# EAGLE design LedSignalDispatcher (EAGLE 6.1)
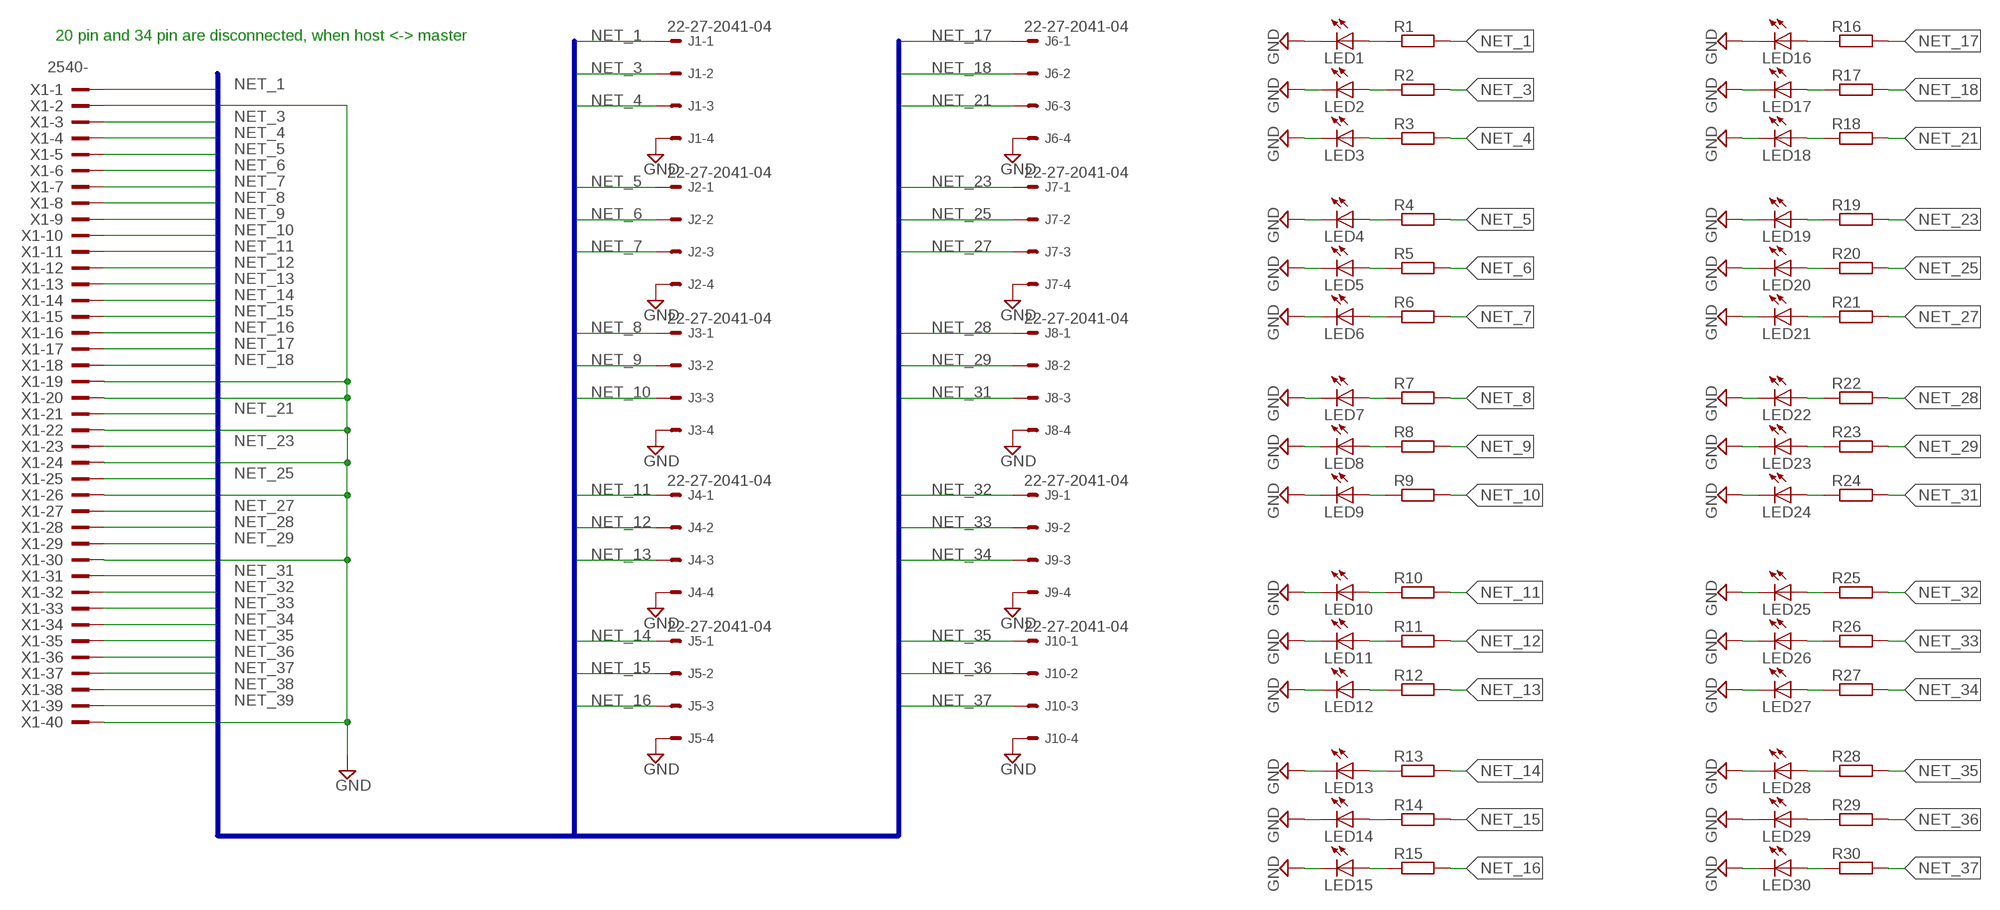
[diagram p0: schematic, sheet 1]

## Parts
J1  22-27-2041-04  [6410-04]
J2  22-27-2041-04  [6410-04]
J3  22-27-2041-04  [6410-04]
J4  22-27-2041-04  [6410-04]
J5  22-27-2041-04  [6410-04]
J6  22-27-2041-04  [6410-04]
J7  22-27-2041-04  [6410-04]
J8  22-27-2041-04  [6410-04]
J9  22-27-2041-04  [6410-04]
J10  22-27-2041-04  [6410-04]
LED1  LEDP-LCC-2  [P-LCC-2]
LED2  LEDP-LCC-2  [P-LCC-2]
LED3  LEDP-LCC-2  [P-LCC-2]
LED4  LEDP-LCC-2  [P-LCC-2]
LED5  LEDP-LCC-2  [P-LCC-2]
LED6  LEDP-LCC-2  [P-LCC-2]
LED7  LEDP-LCC-2  [P-LCC-2]
LED8  LEDP-LCC-2  [P-LCC-2]
LED9  LEDP-LCC-2  [P-LCC-2]
LED10  LEDP-LCC-2  [P-LCC-2]
LED11  LEDP-LCC-2  [P-LCC-2]
LED12  LEDP-LCC-2  [P-LCC-2]
LED13  LEDP-LCC-2  [P-LCC-2]
LED14  LEDP-LCC-2  [P-LCC-2]
LED15  LEDP-LCC-2  [P-LCC-2]
LED16  LEDP-LCC-2  [P-LCC-2]
LED17  LEDP-LCC-2  [P-LCC-2]
LED18  LEDP-LCC-2  [P-LCC-2]
LED19  LEDP-LCC-2  [P-LCC-2]
LED20  LEDP-LCC-2  [P-LCC-2]
LED21  LEDP-LCC-2  [P-LCC-2]
LED22  LEDP-LCC-2  [P-LCC-2]
LED23  LEDP-LCC-2  [P-LCC-2]
LED24  LEDP-LCC-2  [P-LCC-2]
LED25  LEDP-LCC-2  [P-LCC-2]
LED26  LEDP-LCC-2  [P-LCC-2]
LED27  LEDP-LCC-2  [P-LCC-2]
LED28  LEDP-LCC-2  [P-LCC-2]
LED29  LEDP-LCC-2  [P-LCC-2]
LED30  LEDP-LCC-2  [P-LCC-2]
R1  SMT-REF  [SMT-REF]
R2  SMT-REF  [SMT-REF]
R3  SMT-REF  [SMT-REF]
R4  SMT-REF  [SMT-REF]
R5  SMT-REF  [SMT-REF]
R6  SMT-REF  [SMT-REF]
R7  SMT-REF  [SMT-REF]
R8  SMT-REF  [SMT-REF]
R9  SMT-REF  [SMT-REF]
R10  SMT-REF  [SMT-REF]
R11  SMT-REF  [SMT-REF]
R12  SMT-REF  [SMT-REF]
R13  SMT-REF  [SMT-REF]
R14  SMT-REF  [SMT-REF]
R15  SMT-REF  [SMT-REF]
R16  SMT-REF  [SMT-REF]
R17  SMT-REF  [SMT-REF]
R18  SMT-REF  [SMT-REF]
R19  SMT-REF  [SMT-REF]
R20  SMT-REF  [SMT-REF]
R21  SMT-REF  [SMT-REF]
R22  SMT-REF  [SMT-REF]
R23  SMT-REF  [SMT-REF]
R24  SMT-REF  [SMT-REF]
R25  SMT-REF  [SMT-REF]
R26  SMT-REF  [SMT-REF]
R27  SMT-REF  [SMT-REF]
R28  SMT-REF  [SMT-REF]
R29  SMT-REF  [SMT-REF]
R30  SMT-REF  [SMT-REF]
X1  2540-  [PAK100/2500-40]

## Nets
GND: J1.4 J2.4 J3.4 J4.4 J5.4 J6.4 J7.4 J8.4 J9.4 J10.4 LED1.C LED2.C LED3.C LED4.C LED5.C LED6.C LED7.C LED8.C LED9.C LED10.C LED11.C LED12.C LED13.C LED14.C LED15.C LED16.C LED17.C LED18.C LED19.C LED20.C LED21.C LED22.C LED23.C LED24.C LED25.C LED26.C LED27.C LED28.C LED29.C LED30.C X1.2 X1.19 X1.20 X1.22 X1.24 X1.26 X1.30 X1.40
N$1: LED1.A R1.2
N$2: LED2.A R2.2
N$3: LED3.A R3.2
N$4: LED4.A R4.2
N$5: LED5.A R5.2
N$6: LED6.A R6.2
N$7: LED7.A R7.2
N$8: LED8.A R8.2
N$9: LED9.A R9.2
N$10: LED10.A R10.2
N$11: LED11.A R11.2
N$12: LED12.A R12.2
N$13: LED13.A R13.2
N$14: LED14.A R14.2
N$15: LED15.A R15.2
N$16: LED16.A R16.2
N$17: LED17.A R17.2
N$18: LED18.A R18.2
N$19: LED19.A R19.2
N$20: LED20.A R20.2
N$21: LED21.A R21.2
N$22: LED22.A R22.2
N$23: LED23.A R23.2
N$24: LED24.A R24.2
N$25: LED25.A R25.2
N$26: LED26.A R26.2
N$27: LED27.A R27.2
N$28: LED28.A R28.2
N$29: LED29.A R29.2
N$30: LED30.A R30.2
NET_1: J1.1 R1.1 X1.1
NET_3: J1.2 R2.1 X1.3
NET_4: J1.3 R3.1 X1.4
NET_5: J2.1 R4.1 X1.5
NET_6: J2.2 R5.1 X1.6
NET_7: J2.3 R6.1 X1.7
NET_8: J3.1 R7.1 X1.8
NET_9: J3.2 R8.1 X1.9
NET_10: J3.3 R9.1 X1.10
NET_11: J4.1 R10.1 X1.11
NET_12: J4.2 R11.1 X1.12
NET_13: J4.3 R12.1 X1.13
NET_14: J5.1 R13.1 X1.14
NET_15: J5.2 R14.1 X1.15
NET_16: J5.3 R15.1 X1.16
NET_17: J6.1 R16.1 X1.17
NET_18: J6.2 R17.1 X1.18
NET_21: J6.3 R18.1 X1.21
NET_23: J7.1 R19.1 X1.23
NET_25: J7.2 R20.1 X1.25
NET_27: J7.3 R21.1 X1.27
NET_28: J8.1 R22.1 X1.28
NET_29: J8.2 R23.1 X1.29
NET_31: J8.3 R24.1 X1.31
NET_32: J9.1 R25.1 X1.32
NET_33: J9.2 R26.1 X1.33
NET_34: J9.3 R27.1 X1.34
NET_35: J10.1 R28.1 X1.35
NET_36: J10.2 R29.1 X1.36
NET_37: J10.3 R30.1 X1.37
NET_38: X1.38
NET_39: X1.39

## Buses
NET_[1..40]

## Notes on the sheet
- 20 pin and 34 pin are disconnected, when host <-> master

## Library data of the parts
J1-J10 = con-molex:22-?-04: CONNECTOR wire to board 2.54 mm (.1 inch) pitch header; OC_FARNELL: unknown; OC_NEWARK: unknown
LED1-LED30 = led:LED: LED OSRAM: - CHIPLED LG R971, LG N971, LY N971, LG Q971, LY Q971, LO R971, LY R971 LH N974, LH R974 LS Q976, LO Q976, LY Q976 LO Q996 - Hyper CHIPLED LW Q18S LB Q993, LB Q99A, LB R99A - SideLED LS A670, LO A670, LY A670, LG A670, LP A670 LB A673, LV A673, LT A673, LW A673 LH A674 LY A675 LS A676, LA A676, LO A676, LY A676, LW A676 LS A679, LY A679, LG A679 - Hyper Micro SIDELED® LS Y876, LA Y876, LO Y876, LY Y876 LT Y87S - SmartLED LW L88C, LW L88S LB L89C, LB L89S, LG L890 LS L89K, LO L89K, LY L89K LS L896, LA L896, LO L896, LY L896 - TOPLED LS T670, LO T670, LY T670, LG T670, LP T670 LSG T670, LSP T670, LSY T670, LOP T670, LYG T670 LG T671, LOG T671, LSG T671 LB T673, LV T673, LT T673, LW T673 LH T674 LS T676, LA T676, LO T676, LY T676, LB T676, LH T676, LSB T676, LW T676 LB T67C, LV T67C, LT T67C, LS T67K, LO T67K, LY T67K, LW E67C LS E67B, LA E67B, LO E67B, LY E67B, LB E67C, LV E67C, LT E67C LW T67C LS T679, LY T679, LG T679 LS T770, LO T770, LY T770, LG T770, LP T770 LB T773, LV T773, LT T773, LW T773 LH T774 LS E675, LA E675, LY E675, LS T675 LS T776, LA T776, LO T776, LY T776, LB T776 LHGB T686 LT T68C, LB T68C - Hyper Mini TOPLED® LB M676 - Mini TOPLED Santana® LG M470 LS M47K, LO M47K, LY M47K Source: http://www.osram.convergy.de LUXEON: - LUMILED® LXK2-PW12-R00, LXK2-PW12-S00, LXK2-PW14-U00, LXK2-PW14-V00 LXK2-PM12-R00, LXK2-PM12-S00, LXK2-PM14-U00 LXK2-PE12-Q00, LXK2-PE12-R00, LXK2-PE12-S00, LXK2-PE14-T00, LXK2-PE14-U00 LXK2-PB12-K00, LXK2-PB12-L00, LXK2-PB12-M00, LXK2-PB14-N00, LXK2-PB14-P00, LXK2-PB14-Q00 LXK2-PR12-L00, LXK2-PR12-M00, LXK2-PR14-Q00, LXK2-PR14-R00 LXK2-PD12-Q00, LXK2-PD12-R00, LXK2-PD12-S00 LXK2-PH12-R00, LXK2-PH12-S00 LXK2-PL12-P00, LXK2-PL12-Q00, LXK2-PL12-R00 Source: www.luxeon.com KINGBRIGHT: KA-3528ASYC Source: www.kingbright.com
R1-R30 = resistor-shunt:SMT-REF: SMD SHUNT RESISTOR; OC_FARNELL: unknown; OC_NEWARK: unknown
X1 = con-3m:2540-: 3M (TM) Pak 100 4-Wall Header Source: 3M; OC_FARNELL: unknown; OC_NEWARK: unknown

## Net classes
0 default: width 0.203 mm

## Board
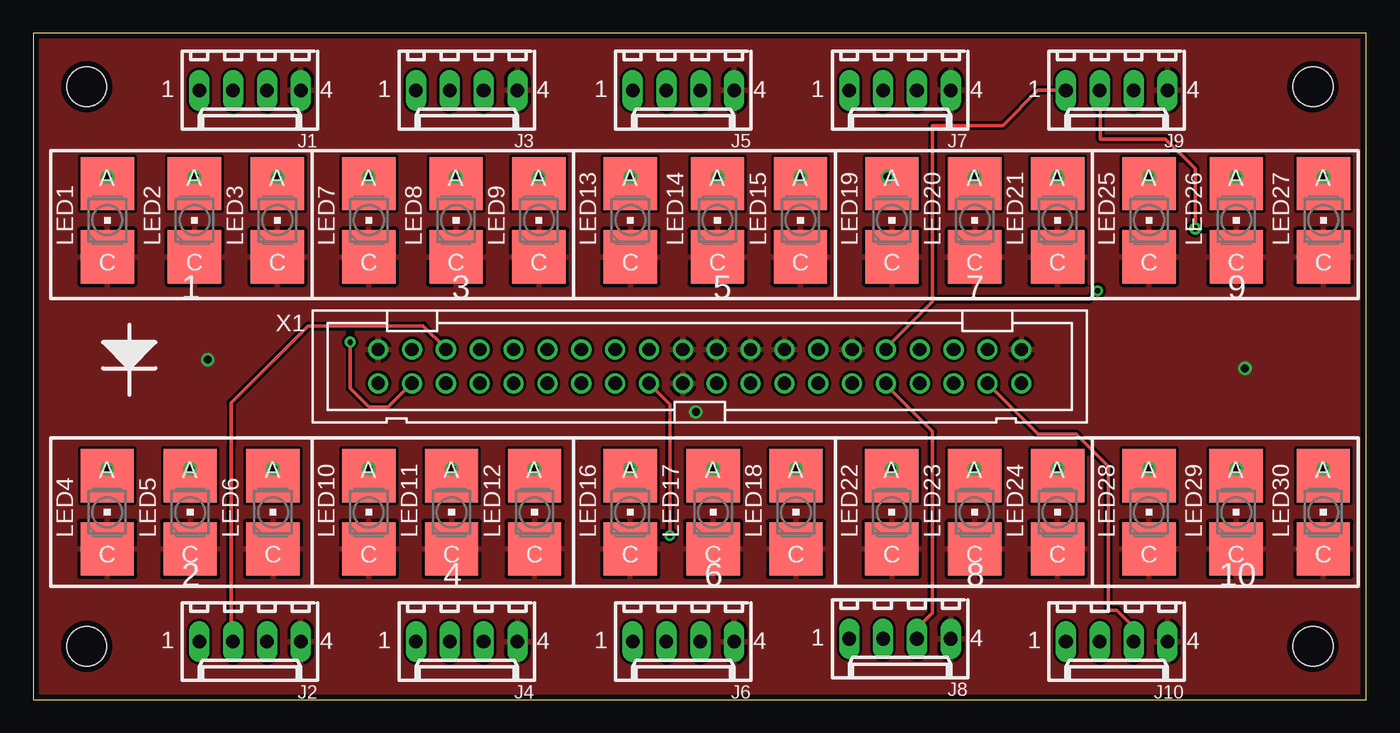
[diagram p1: board, top side]
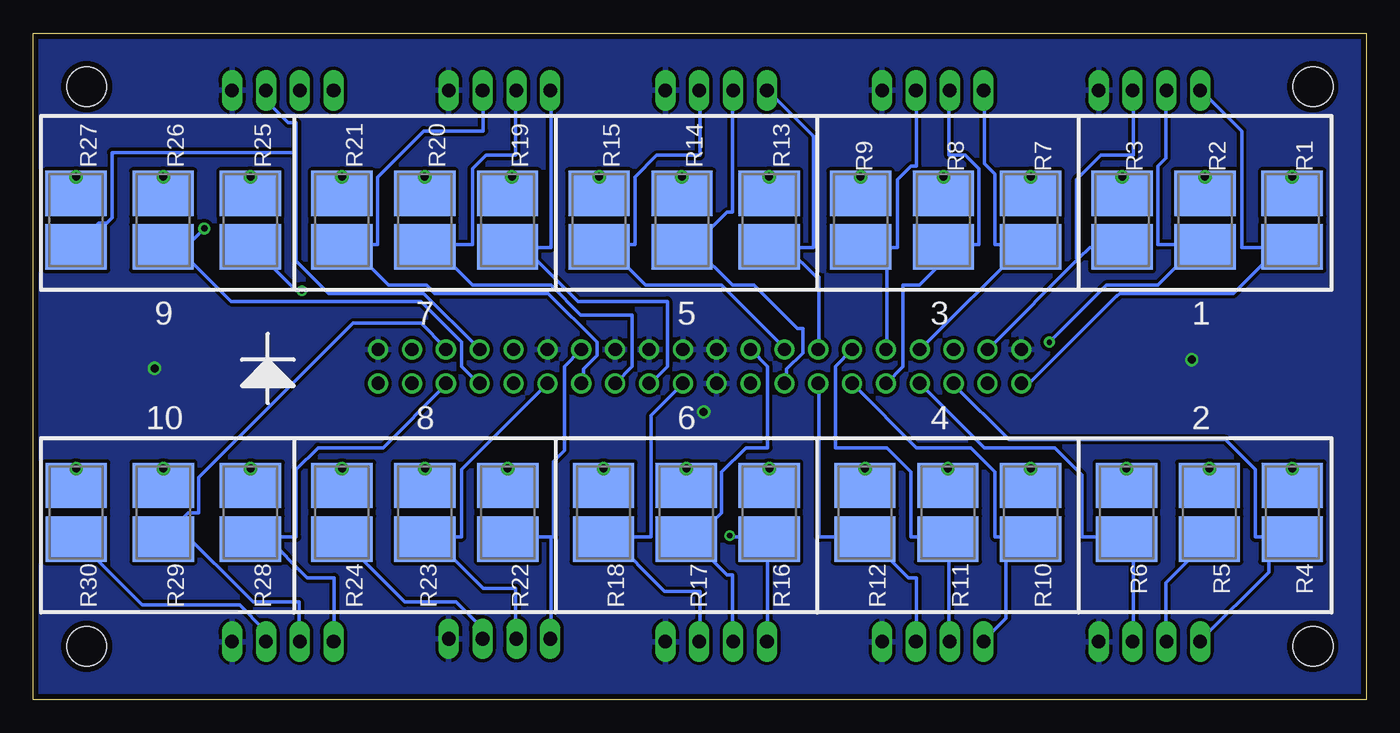
[diagram p2: board, bottom side, seen from below]

Size 100 x 50 mm. Coordinates in mm from the lower left corner, seen from the top.
Outline: 0,0 100,0 100,50 0,50 0,0
Copper layers (1*16): Top 0.035mm / dielectric 1.5mm / Bottom 0.035mm
Design rules: minimum track width 10mil, minimum drill 12mil, track to track 8mil, track to pad 8mil, pad to pad 8mil, via to via 8mil, smd to smd 0mil, copper to edge 16mil, drill to drill 8mil, minimum pad ring 10mil, minimum via ring 8mil, stop-mask expansion 4mil, vias tented up to drill 0mil, thermal gap 10mil
Holes 3 mm at 4,46 4,4 96,46 96,4

### Footprints (pad centres in the part's own frame; a part is rotated, then mirrored left to right if it is on the bottom)
6410-04 = drill 1.016 long: 1 3.81,0; 2 1.27,0; 3 -1.27,0; 4 -3.81,0
P-LCC-2 = smd 4 x 4: A 0,2.75; C 0,-2.75
SMT-REF = smd 3.4 x 4.6: 1 2.007,0; 2 -2.007,0
PAK100/2500-40 = drill 1 pad 1.422: 1 -24.13,-1.27; 2 -24.13,1.27; 3 -21.59,-1.27; 4 -21.59,1.27; 5 -19.05,-1.27; 6 -19.05,1.27; 7 -16.51,-1.27; 8 -16.51,1.27; 9 -13.97,-1.27; 10 -13.97,1.27; 11 -11.43,-1.27; 12 -11.43,1.27; 13 -8.89,-1.27; 14 -8.89,1.27; 15 -6.35,-1.27; 16 -6.35,1.27; 17 -3.81,-1.27; 18 -3.81,1.27; 19 -1.27,-1.27; 20 -1.27,1.27; 21 1.27,-1.27; 22 1.27,1.27; 23 3.81,-1.27; 24 3.81,1.27; 25 6.35,-1.27; 26 6.35,1.27; 27 8.89,-1.27; 28 8.89,1.27; 29 11.43,-1.27; 30 11.43,1.27; 31 13.97,-1.27; 32 13.97,1.27; 33 16.51,-1.27; 34 16.51,1.27; 35 19.05,-1.27; 36 19.05,1.27; 37 21.59,-1.27; 38 21.59,1.27; 39 24.13,-1.27; 40 24.13,1.27

### Placement (x,y rotation side)
J1  16.26,45.72 180 top
J2  16.26,4.35 180 top
J3  32.51,45.72 180 top
J4  32.51,4.35 180 top
J5  48.77,45.72 180 top
J6  48.77,4.35 180 top
J7  65.02,45.72 180 top
J8  65.02,4.56 180 top
J9  81.28,45.72 180 top
J10  81.28,4.35 180 top
LED1  5.55,35.97 0 top
LED2  12.09,35.97 0 top
LED3  18.31,35.97 0 top
LED4  5.55,14.06 0 top
LED5  11.76,14.06 0 top
LED6  17.98,14.06 0 top
LED7  25.17,35.97 0 top
LED8  31.71,35.97 0 top
LED9  37.93,35.97 0 top
LED10  25.17,14.06 0 top
LED11  31.38,14.06 0 top
LED12  37.6,14.06 0 top
LED13  44.79,35.97 0 top
LED14  51.33,35.97 0 top
LED15  57.55,35.97 0 top
LED16  44.79,14.06 0 top
LED17  51,14.06 0 top
LED18  57.22,14.06 0 top
LED19  64.41,35.97 0 top
LED20  70.63,35.97 0 top
LED21  76.84,35.97 0 top
LED22  64.41,14.06 0 top
LED23  70.62,14.06 0 top
LED24  76.84,14.06 0 top
LED25  83.71,35.97 0 top
LED26  90.25,35.97 0 top
LED27  96.79,35.97 0 top
LED28  83.7,14.06 0 top
LED29  90.24,14.06 0 top
LED30  96.78,14.06 0 top
R1  5.55,35.97 270 bottom
R2  12.09,35.97 270 bottom
R3  18.31,35.97 270 bottom
R4  5.55,14.06 270 bottom
R5  11.76,14.06 270 bottom
R6  17.98,14.06 270 bottom
R7  25.17,35.97 270 bottom
R8  31.71,35.97 270 bottom
R9  37.93,35.97 270 bottom
R10  25.17,14.06 270 bottom
R11  31.38,14.06 270 bottom
R12  37.6,14.06 270 bottom
R13  44.79,35.97 270 bottom
R14  51.33,35.97 270 bottom
R15  57.55,35.97 270 bottom
R16  44.79,14.06 270 bottom
R17  51,14.06 270 bottom
R18  57.22,14.06 270 bottom
R19  64.41,35.97 270 bottom
R20  70.63,35.97 270 bottom
R21  76.84,35.97 270 bottom
R22  64.41,14.06 270 bottom
R23  70.62,14.06 270 bottom
R24  76.84,14.06 270 bottom
R25  83.71,35.97 270 bottom
R26  90.25,35.97 270 bottom
R27  96.79,35.97 270 bottom
R28  83.7,14.06 270 bottom
R29  90.24,14.06 270 bottom
R30  96.78,14.06 270 bottom
X1  50,25 0 top

### Tracks (layer width: path | path; a pad name or v marks a point on that pad's centre or on a via)
GND  (via drill 0.6)
  other vias: 13.08,25.51 90.91,24.85 49.7,21.58
  pour Bottom (isolate 0.254): 100.33,50.8 0,50.8 0,0 100.33,0
  pour Top: 0,50.36 0,-0.65 100.06,-0.65 100.06,50.36
N$1  (via drill 0.6)
  Top 0.406: v5.55,39.24 4.25,37.93 4.25,38.59 5.55,38.59 LED1.A
  Bottom 0.406: v5.55,39.24 5.55,37.93 R1.2
N$2  (via drill 0.6)
  Top 0.406: v12.1,39.24 12.75,39.24 13.4,38.59 12.75,38.59 LED2.A
  Bottom 0.406: v12.1,39.24 R2.2
N$3  (via drill 0.6)
  Top 0.406: v18.31,39.24 18.31,38.59 LED3.A
  Bottom 0.406: 18.31,37.93 v18.31,39.24 | 18.31,37.93 16.35,37.93 | 18.31,37.93 R3.2
N$4  (via drill 0.6)
  Top 0.406: v5.55,17.33 5.55,16.67 LED4.A
  Bottom 0.406: v5.55,17.33 4.89,16.02 3.58,16.02 5.55,16.02 R4.2
N$5  (via drill 0.6)
  Top 0.406: v11.76,17.33 11.76,16.67 LED5.A
  Bottom 0.406: v11.76,17.33 10.46,16.02 9.8,16.02 11.76,16.02 R5.2
N$6  (via drill 0.6)
  Top 0.406: v17.98,17.33 17.98,16.67 LED6.A
  Bottom 0.406: v17.98,17.33 16.67,16.02 16.02,16.02 17.98,16.02 R6.2
N$7  (via drill 0.6)
  Top 0.406: v25.18,39.24 25.18,38.59 LED7.A
  Bottom 0.406: 25.18,37.93 v25.18,39.24 | 25.18,37.93 23.21,37.93 | 25.18,37.93 R7.2
N$8  (via drill 0.6)
  Top 0.406: v31.71,39.24 31.71,38.59 LED8.A
  Bottom 0.406: 31.71,37.93 v31.71,39.24 | 31.71,37.93 29.75,37.93 | 31.71,37.93 R8.2
N$9  (via drill 0.6)
  Top 0.406: v37.93,39.24 39.24,37.93 39.24,38.59 38.59,38.59 LED9.A
  Bottom 0.406: v37.93,39.24 38.59,37.93 R9.2
N$10  (via drill 0.6)
  Top 0.406: v25.17,17.33 25.17,16.67 LED10.A
  Bottom 0.406: v25.17,17.33 23.86,16.02 23.2,16.02 25.17,16.02 R10.2
N$11  (via drill 0.6)
  Top 0.406: v31.38,17.33 31.38,16.67 LED11.A
  Bottom 0.406: v31.38,17.33 30.73,15.37 29.42,16.02 31.38,16.02 R11.2
N$12  (via drill 0.6)
  Top 0.406: v37.6,17.33 37.6,16.67 LED12.A
  Bottom 0.406: v37.6,17.33 36.95,16.67 37.6,16.02 | 37.6,16.02 | 37.6,16.02 R12.2
N$13  (via drill 0.6)
  Top 0.406: v44.8,39.24 44.8,38.59 LED13.A
  Bottom 0.406: 44.8,37.93 v44.8,39.24 | 44.8,37.93 42.83,37.93 | 44.8,37.93 R13.2
N$14  (via drill 0.6)
  Top 0.406: v51.34,39.24 52.64,37.93 52.64,38.59 51.99,38.59 LED14.A
  Bottom 0.406: v51.34,39.24 51.99,37.93 R14.2
N$15  (via drill 0.6)
  Top 0.406: v57.55,39.24 57.55,38.59 LED15.A
  Bottom 0.406: v57.55,39.24 58.86,39.24 56.24,37.93 57.55,37.93 R15.2
N$16  (via drill 0.6)
  Top 0.406: v44.79,17.33 44.79,16.67 LED16.A
  Bottom 0.406: v44.79,17.33 44.79,16.67 42.82,16.02 44.13,16.02 R16.2
N$17  (via drill 0.6)
  Top 0.406: v51,17.33 52.31,16.02 52.31,16.67 51.66,16.67 LED17.A
  Bottom 0.406: v51,17.33 51.66,16.02 R17.2
N$18  (via drill 0.6)
  Top 0.406: v57.22,17.33 57.22,16.67 LED18.A
  Bottom 0.406: v57.22,17.33 55.91,16.02 55.26,16.02 57.22,16.02 R18.2
N$19  (via drill 0.6)
  Top 0.406: v64.09,39.24 65.72,37.93 65.72,38.59 65.07,38.59 LED19.A
  Bottom 0.406: v64.09,39.24 65.07,37.93 R19.2
N$20  (via drill 0.6)
  Top 0.406: v70.63,39.24 70.63,38.59 LED20.A
  Bottom 0.406: v70.63,39.24 69.32,38.59 69.98,37.93 70.63,37.93 R20.2
N$21  (via drill 0.6)
  Top 0.406: 77.49,38.59 v76.84,39.24 | 77.49,38.59 78.15,37.93 | 77.49,38.59 LED21.A
  Bottom 0.406: v76.84,39.24 77.49,37.93 R21.2
N$22  (via drill 0.6)
  Top 0.406: v64.41,17.33 65.71,16.02 65.71,16.67 65.06,16.67 LED22.A
  Bottom 0.406: v64.41,17.33 65.06,16.02 R22.2
N$23  (via drill 0.6)
  Top 0.406: v70.62,17.33 70.62,16.67 LED23.A
  Bottom 0.406: v70.62,17.33 71.28,17.33 69.31,16.02 70.62,16.02 R23.2
N$24  (via drill 0.6)
  Top 0.406: v76.84,17.33 76.84,16.67 LED24.A
  Bottom 0.406: v76.84,17.33 75.53,16.67 74.88,16.02 76.84,16.02 R24.2
N$25  (via drill 0.6)
  Top 0.406: v83.71,39.24 83.71,38.59 LED25.A
  Bottom 0.406: v83.71,39.24 82.4,38.59 83.06,37.93 83.71,37.93 R25.2
N$26  (via drill 0.6)
  Top 0.406: v90.25,39.24 90.25,38.59 LED26.A
  Bottom 0.406: v90.25,39.24 90.91,39.24 88.94,37.93 90.25,37.93 R26.2
N$27  (via drill 0.6)
  Top 0.406: 95.48,38.59 v96.79,39.24 | 95.48,38.59 96.79,38.59 LED27.A | 95.48,38.59
  Bottom 0.406: v96.79,39.24 96.79,37.93 R27.2
N$28  (via drill 0.6)
  Top 0.406: v83.7,17.33 83.7,16.67 LED28.A
  Bottom 0.406: v83.7,17.33 83.05,16.67 83.7,16.02 R28.2
N$29  (via drill 0.6)
  Top 0.406: v90.24,17.33 90.24,16.67 LED29.A
  Bottom 0.406: v90.24,17.33 89.59,16.02 90.24,15.37 90.24,16.02 R29.2
N$30  (via drill 0.6)
  Top 0.406: v96.78,17.33 96.78,16.67 LED30.A
  Bottom 0.406: 96.78,16.02 v96.78,17.33 | 96.78,16.02 94.82,16.02 96.78,16.02 | 96.78,16.02 R30.2
NET_1
  Bottom 0.254: 6.5,33.93 9.96,30.48 18.49,30.48 18.69,30.28 18.73,30.31 | 6.5,33.93 5.69,33.93 R1.1 6.5,33.93 | X1.1 25.81,23.77 25.26,23.77 18.73,30.31 | 6.5,33.93 9.35,33.93 9.35,42.67 12.39,45.72 J1.1 | 18.73,30.31 18.71,30.32
NET_3  (via drill 0.4)
  Top 0.254: v23.77,26.82 23.77,23.37 25.2,21.95 26.62,21.95 28.25,23.57 X1.3
  Bottom 0.254: v23.77,26.82 19.51,31.09 15.65,31.09 12.8,33.93 12.19,33.93 R2.1 12.19,34.14 15.65,34.14 15.65,40.03 15.04,40.64 15.04,45.72 J1.2
NET_4
  Bottom 0.254: 21.54,33.12 20.73,33.93 18.49,33.93 R3.1 | 21.54,33.12 28.25,26.42 X1.4 | 21.54,33.12 21.74,33.12 21.74,39.01 19.91,40.84 17.48,40.84 17.48,45.72 J1.3
NET_5
  Bottom 0.254: 7.32,12.19 5.69,12.19 R4.1 7.32,12.19 | 7.32,12.19 8.33,12.19 8.33,17.27 10.57,19.51 26.82,19.51 30.89,23.57 X1.5 | 7.32,12.19 7.32,9.55 12.39,4.47 J2.1
NET_6
  Top 0.254: X1.6 30.89,26.42 29.26,28.04 20.62,28.04 14.84,22.26 14.84,19.1 | J2.2 14.83,4.47 14.83,19.1 14.84,19.1 | 14.84,19.1 14.84,19.03
  Bottom 0.254: R5.1 11.79,11.99 15.04,8.74 15.04,4.47 J2.2
NET_7
  Bottom 0.254: X1.7 33.33,23.57 28.65,18.9 23.37,18.9 21.34,16.87 21.34,12.19 18.09,12.19 R6.1 17.88,11.99 17.48,11.99 17.48,4.47 J2.3
NET_8
  Bottom 0.254: X1.8 33.33,26.42 25.81,33.93 25.2,33.93 R7.1 25.2,34.14 27.84,34.14 27.84,39.42 28.65,40.23 28.65,45.72 J3.1
NET_9
  Bottom 0.254: X1.9 35.97,23.77 34.75,24.99 34.75,31.09 33.53,31.09 31.9,32.72 31.9,33.93 R8.1 31.7,34.14 29.06,34.14 29.06,39.83 30.07,40.84 31.29,40.84 31.29,45.72 J3.2
NET_10
  Bottom 0.254: 35.97,33.93 35.97,26.42 X1.10 | 35.97,33.93 37.8,33.93 R9.1 35.97,33.93 | 35.97,33.93 35.15,33.93 35.15,39.01 34.14,40.03 33.73,40.03 33.73,45.72 J3.3
NET_11
  Bottom 0.254: 27.03,12.19 25.2,12.19 R10.1 27.03,12.19 | 27.03,12.19 27.84,12.19 27.84,17.07 29.67,18.9 33.73,18.9 38.41,23.57 X1.11 | 27.03,12.19 27.03,6.1 28.65,4.47 J4.1
NET_12
  Bottom 0.254: X1.12 38.61,26.21 39.83,24.99 39.83,18.9 35.97,18.9 34.14,17.07 34.14,12.19 31.5,12.19 R11.1 31.29,11.99 31.29,4.47 J4.2
NET_13
  Bottom 0.254: X1.13 41.05,23.57 41.05,12.19 37.8,12.19 R12.1 37.59,11.99 37.19,11.99 34.34,9.14 33.73,9.14 33.73,4.47 J4.3
NET_14
  Bottom 0.254: 43.48,33.93 41.25,31.7 41.05,31.7 41.05,26.42 X1.14 | 43.48,33.93 44.7,33.93 R13.1 43.48,33.93 | 43.48,33.93 41.45,33.93 41.45,42.27 44.91,45.72 J5.1
NET_15
  Bottom 0.254: 50.6,33.93 51.21,33.93 R14.1 50.6,33.93 | 50.6,33.93 50.39,33.93 47.55,31.09 45.92,31.09 42.67,27.84 42.27,27.84 42.27,26.01 43.48,24.79 43.48,23.77 X1.15 | 50.6,33.93 47.95,36.58 47.55,36.58 47.55,45.72 J5.2
NET_16
  Bottom 0.254: X1.16 43.69,26.42 48.36,31.09 54.05,31.09 56.9,33.93 57.51,33.93 R15.1 57.51,34.14 54.86,34.14 54.86,39.22 53.24,40.84 49.99,40.84 49.99,45.72 J5.3
NET_17  (via drill 0.4)
  Top 0.254: v47.75,12.31 47.75,22.15 46.33,23.57 X1.17
  Bottom 0.254: J6.1 44.91,4.47 44.91,11.99 R16.1 44.91,12.19 47.51,12.19 47.73,12.42 | 47.73,12.42 47.74,12.43 | v47.75,12.31 47.75,12.39 47.73,12.42
NET_18
  Bottom 0.254: X1.18 46.13,26.21 44.91,24.99 44.91,18.9 46.53,18.9 48.36,17.07 48.36,14.02 50.19,12.19 50.8,12.19 R17.1 50.8,11.99 50.6,11.99 47.95,9.35 47.55,9.35 47.55,4.47 J6.2
NET_21
  Bottom 0.254: 56.69,12.19 57.1,12.19 R18.1 56.69,12.19 | 56.69,12.19 53.65,12.19 53.65,21.34 51.41,23.57 X1.21 | 56.69,12.19 52.63,8.13 49.99,8.13 49.99,4.47 J6.3
NET_23
  Bottom 0.254: 63.2,33.93 59.13,29.87 52.43,29.87 52.43,24.99 53.65,23.77 X1.23 | 63.2,33.93 64.41,33.93 R19.1 63.2,33.93 | 63.2,33.93 61.16,33.93 61.16,45.72 J7.1
NET_25
  Bottom 0.254: X1.25 56.29,23.77 55.07,24.99 55.07,28.85 58.93,28.85 61.16,31.09 67.06,31.09 69.9,33.93 70.51,33.93 R20.1 70.51,34.14 67.06,34.14 67.06,39.83 66.04,40.84 63.8,40.84 63.8,45.72 J7.2
NET_27
  Bottom 0.254: X1.27 58.73,23.77 58.73,24.79 57.71,25.81 57.71,26.82 61.37,30.48 69.9,30.48 70.51,31.09 73.36,31.09 76.2,33.93 76.81,33.93 R21.1 76.81,34.14 74.17,34.14 74.17,39.22 70.71,42.67 66.24,42.67 66.24,45.72 J7.3
NET_28
  Bottom 0.254: 61.16,12.19 64.21,12.19 R22.1 | 61.16,12.19 60.96,12.19 60.96,17.88 60.15,18.69 60.15,24.99 58.93,26.21 X1.28 | 61.16,12.19 61.16,4.67 J8.1
NET_29
  Bottom 0.254: 70.1,12.19 70.51,12.19 R23.1 70.1,12.19 | 70.1,12.19 67.87,12.19 67.87,17.27 61.57,23.57 X1.29 | 70.1,12.19 66.24,8.33 63.8,8.33 63.8,4.67 J8.2
NET_31
  Top 0.254: X1.31 64.01,23.57 67.46,20.12 67.46,6.5 66.45,5.49 66.45,4.67 J8.3
  Bottom 0.254: R24.1 76.81,11.99 72.14,7.32 68.28,7.32 66.45,5.49 66.45,4.67 J8.3
NET_32  (via drill 0.4)
  Top 0.254: 67.46,30.07 67.46,43.08 72.75,43.08 75.39,45.72 J9.1 | 67.46,30.07 67.46,29.87 64.01,26.42 X1.32 | v79.86,30.68 79.25,30.07 67.46,30.07
  Bottom 0.254: v79.86,30.68 80.26,30.68 83.52,33.93 R25.1
NET_33  (via drill 0.5)
  Top 0.254: v87.17,35.36 87.17,39.83 84.94,42.06 80.06,42.06 80.06,45.72 J9.2
  Bottom 0.254: 89,33.73 89.2,33.93 90.22,33.93 R26.1 89,33.73 | 89,33.73 85.14,29.87 70.92,29.87 67.87,26.82 67.87,24.99 66.65,23.77 X1.33 | v87.17,35.36 88.8,33.73 89,33.73
NET_34
  Bottom 0.254: 80.26,41.05 80.26,43.28 80.87,43.28 82.5,44.91 82.5,45.72 J9.3 | 80.26,41.05 80.26,32.92 77.83,30.48 70.71,30.48 66.65,26.42 X1.34 | 80.26,41.05 94.08,41.05 94.08,36.17 94.49,35.76 95.1,35.76 96.72,34.14 R27.1
NET_35
  Bottom 0.254: 82.5,12.19 83.52,12.19 R28.1 82.5,12.19 | 82.5,12.19 80.26,12.19 80.26,17.27 78.64,18.9 73.76,18.9 69.09,23.57 X1.35 | 82.5,12.19 79.45,9.14 77.42,9.14 77.42,4.47 J10.1
NET_36
  Bottom 0.254: 89.41,13.01 90.22,12.19 R29.1 89.41,13.01 | 89.41,13.01 88.39,14.02 87.58,14.02 87.58,16.66 76,28.25 70.92,28.25 69.09,26.42 X1.36 | 89.41,13.01 89.2,13.01 83.52,7.32 80.06,7.32 80.06,4.47 J10.2
NET_37
  Top 0.254: X1.37 71.73,23.57 75.39,19.91 78.23,19.91 80.67,17.48 80.67,6.71 81.28,6.71 82.5,5.49 82.5,4.47 J10.3
  Bottom 0.254: R30.1 96.72,11.99 91.85,7.11 84.53,7.11 82.7,5.28 82.7,4.47 J10.3

### Text on the board
tNames: 1 | 3 | 5 | 7 | 9 | 2 | 4 | 6 | 8 | 10
bNames: 1 | 3 | 5 | 7 | 9 | 2 | 4 | 6 | 8 | 10